# EAGLE design USB-LPC-Programmer_V3.5 (EAGLE 6.3)
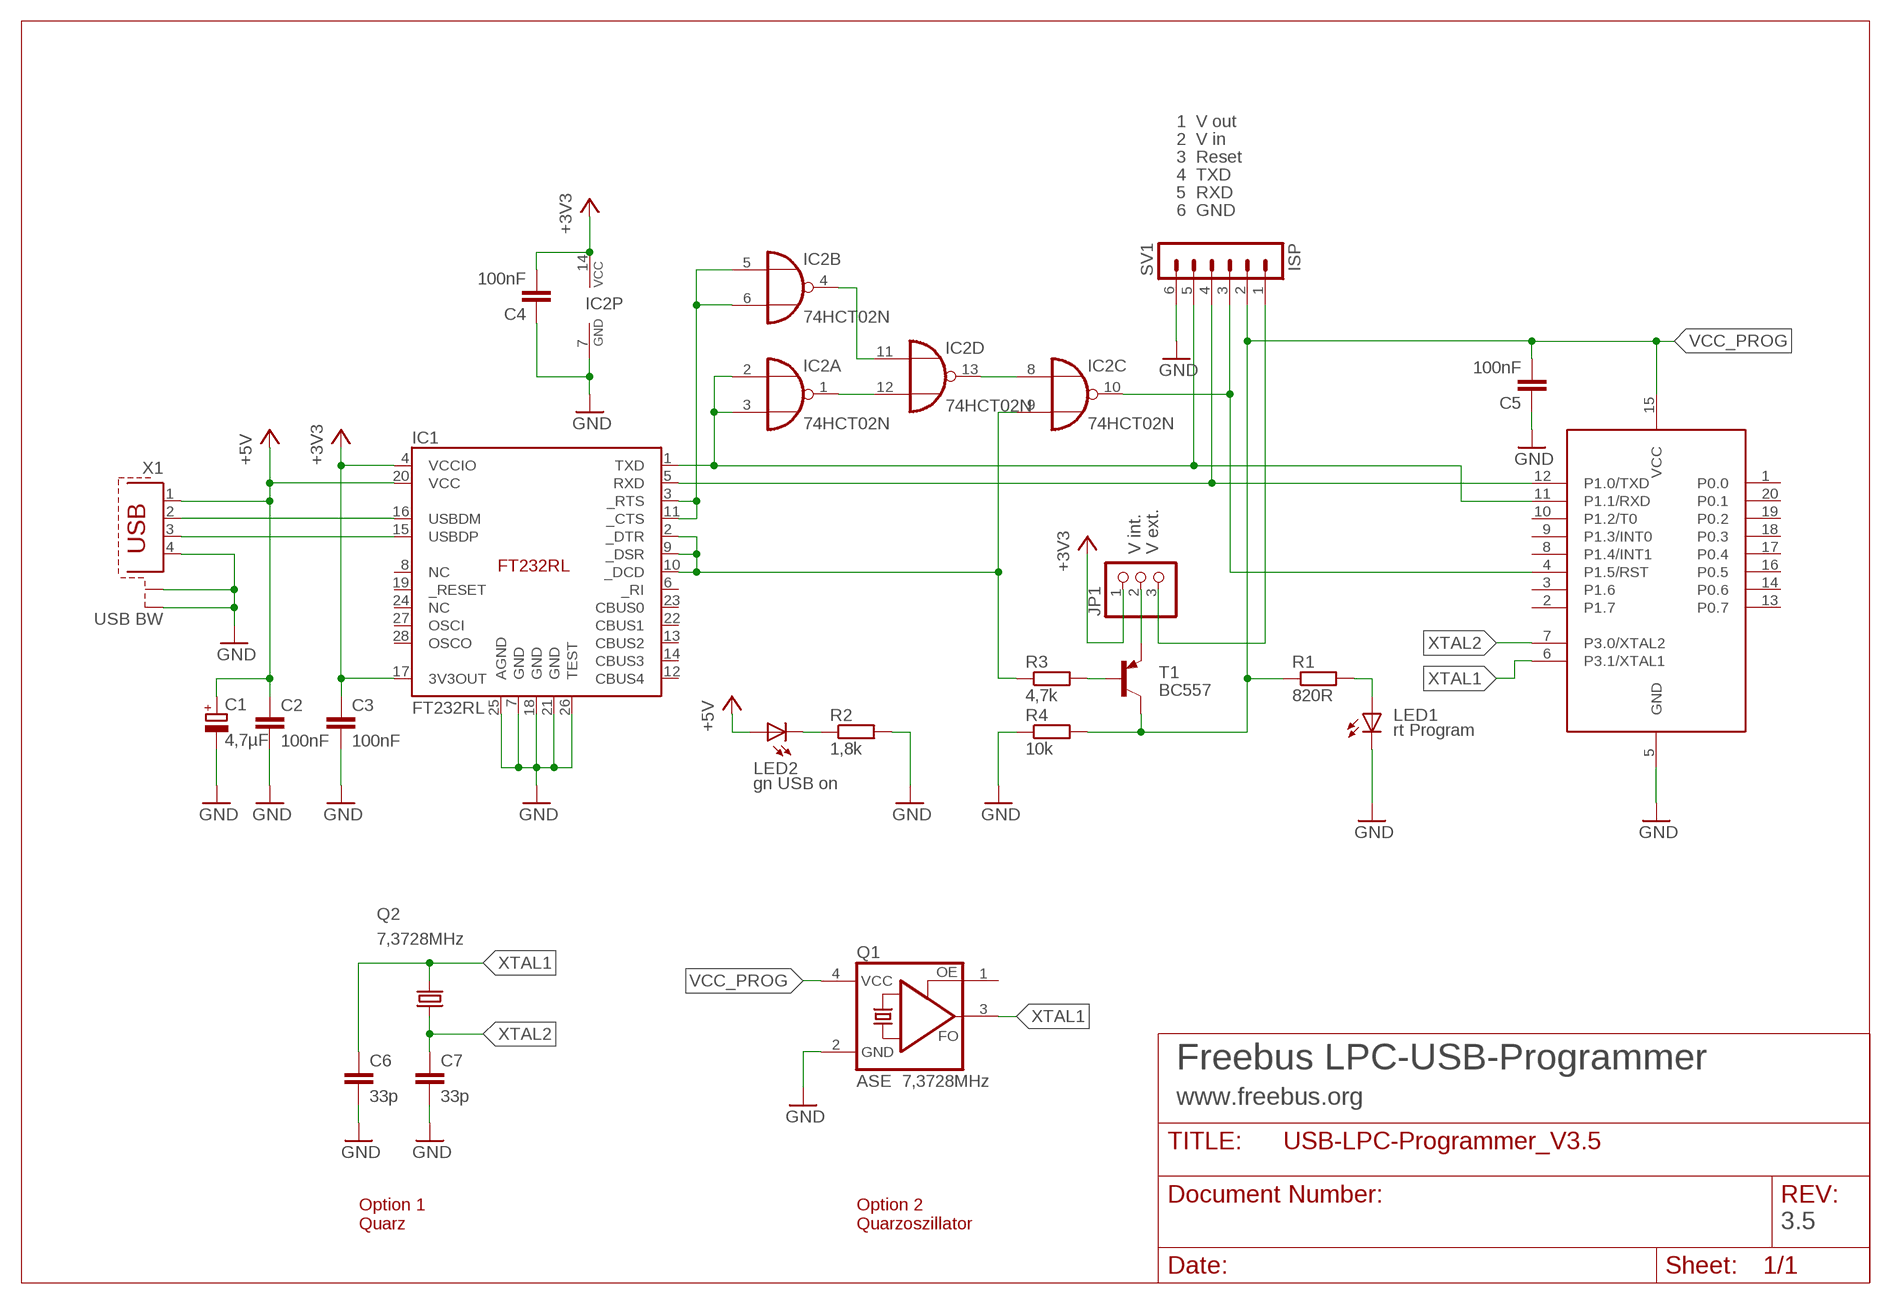
[diagram p0: schematic, sheet 1]

## Parts
89LPC922  LPC-Sockel  89LPC922  [DIL20]
C1  4,7µF  CPOL-EUE2.5-6  [E2,5-6]
C2  100nF  C-EU050-024X044  [C050-024X044]
C3  100nF  C-EU050-024X044  [C050-024X044]
C4  100nF  C-EU050-024X044  [C050-024X044]
C5  100nF  C-EU050-024X044  [C050-024X044]
C6  33p  C-EU025-024X044  [C025-024X044]
C7  33p  C-EU025-024X044  [C025-024X044]
IC1  FT232RL  [SSOP-28]
IC2  74HCT02N  [DIL14]
JP1  PINHD-1X3  [1X03]
LED1  rt Program  LED3MM  [LED3MM]
LED2  gn USB on  LED3MM  [LED3MM]
Q1  ASE 7,3728MHz  ASF1  [ASF]
Q2  7,3728MHz  CRYSTALHC49S  [HC49/S]
R1  820R  R-EU_0207/7  [0207/7]
R2  1,8k  R-EU_0207/7  [0207/7]
R3  4,7k  R-EU_0204/7  [0204/7]
R4  10k  R-EU_0207/7  [0207/7]
SV1  ISP  MA06-1  [MA06-1]
T1  BC557  [TO92]
X1  USB BW  PN61729-S  [PN61729-S]

## Nets
+3V3: C3.1 C4.2 IC1.4(VCCIO) IC1.17(3V3OUT) IC2.14(P:VCC) JP1.1
+5V: C1.+ C2.1 IC1.20(VCC) LED2.A X1.1
GND: 89LPC922.5(GND) C1.- C2.2 C3.2 C4.1 C5.1 C6.2 C7.2 IC1.7(GND) IC1.18(GND) IC1.21(GND) IC1.25(AGND) IC1.26(TEST) IC2.7(P:GND) LED1.K(C) Q1.2(GND) R2.2 R4.1 SV1.6 X1.4 X1.S1 X1.S2
N$3: IC2.4(B:O) IC2.11(D:I0)
N$4: JP1.2 T1.1(E)
N$5: 89LPC922.4(P1.5/RST) IC2.10(C:O) SV1.3
N$7: JP1.3 SV1.1
N$9: LED2.K(C) R2.1
N$10: IC2.1(A:O) IC2.12(D:I1)
N$13: LED1.A R1.2
N$14: IC1.16(USBDM) X1.2
N$15: IC2.8(C:I0) IC2.13(D:O)
N$17: IC1.15(USBDP) X1.3
N$19: R3.2 T1.2(B)
PROG_PWR_ON: IC1.2(_DTR) IC1.9(_DSR) IC1.10(_DCD) IC2.9(C:I1) R3.1
RTS_CTS1: IC1.3(_RTS) IC1.11(_CTS) IC2.5(B:I0) IC2.6(B:I1)
USB_RX: 89LPC922.12(P1.0/TXD) IC1.5(RXD) SV1.4
USB_TX: 89LPC922.11(P1.1/RXD) IC1.1(TXD) IC2.2(A:I0) IC2.3(A:I1) SV1.5
VCC_PROG: 89LPC922.15(VCC) C5.2 Q1.4(VCC) R1.1 R4.2 SV1.2 T1.3(C)
XTAL1: 89LPC922.6(P3.1/XTAL1) C6.1 Q1.3(FO) Q2.2
XTAL2: 89LPC922.7(P3.0/XTAL2) C7.1 Q2.1
Unconnected: 89LPC922.1(P0.0) 89LPC922.2(P1.7) 89LPC922.3(P1.6) 89LPC922.8(P1.4/INT1) 89LPC922.9(P1.3/INT0) 89LPC922.10(P1.2/T0) 89LPC922.13(P0.7) 89LPC922.14(P0.6) 89LPC922.16(P0.5) 89LPC922.17(P0.4) 89LPC922.18(P0.3) 89LPC922.19(P0.2) 89LPC922.20(P0.1) IC1.6(_RI) IC1.8(NC) IC1.12(CBUS4) IC1.13(CBUS2) IC1.14(CBUS3) IC1.19(_RESET) IC1.22(CBUS1) IC1.23(CBUS0) IC1.24(NC) IC1.27(OSCI) IC1.28(OSCO) Q1.1(OE)

## Notes on the sheet
- 1  V out
- 2  V in
- 3  Reset
- 4  TXD
- 5  RXD
- 6  GND
- V int. | V ext.
- Freebus LPC-USB-Programmer
- www.freebus.org
- Option 1
  Quarz
- Option 2
  Quarzoszillator
- 3.5

## Library data of the parts
89LPC922 = micro-philips:89LPC922
C1 = rcl:CPOL-EU: POLARIZED CAPACITOR, European symbol
C2-C7 = rcl:C-EU: CAPACITOR, European symbol
IC1 = ftdi4:FT232RL
IC2 = 74xx-eu:74*02: Quad 2-input NOR gate
JP1 = pinhead:PINHD-1X3: PIN HEADER
LED1 LED2 = led:LED: LED OSRAM: - CHIPLED LG R971, LG N971, LY N971, LG Q971, LY Q971, LO R971, LY R971 LH N974, LH R974 LS Q976, LO Q976, LY Q976 LO Q996 - Hyper CHIPLED LW Q18S LB Q993, LB Q99A, LB R99A - SideLED LS A670, LO A670, LY A670, LG A670, LP A670 LB A673, LV A673, LT A673, LW A673 LH A674 LY A675 LS A676, LA A676, LO A676, LY A676, LW A676 LS A679, LY A679, LG A679 - Hyper Micro SIDELED® LS Y876, LA Y876, LO Y876, LY Y876 LT Y87S - SmartLED LW L88C, LW L88S LB L89C, LB L89S, LG L890 LS L89K, LO L89K, LY L89K LS L896, LA L896, LO L896, LY L896 - TOPLED LS T670, LO T670, LY T670, LG T670, LP T670 LSG T670, LSP T670, LSY T670, LOP T670, LYG T670 LG T671, LOG T671, LSG T671 LB T673, LV T673, LT T673, LW T673 LH T674 LS T676, LA T676, LO T676, LY T676, LB T676, LH T676, LSB T676, LW T676 LB T67C, LV T67C, LT T67C, LS T67K, LO T67K, LY T67K, LW E67C LS E67B, LA E67B, LO E67B, LY E67B, LB E67C, LV E67C, LT E67C LW T67C LS T679, LY T679, LG T679 LS T770, LO T770, LY T770, LG T770, LP T770 LB T773, LV T773, LT T773, LW T773 LH T774 LS E675, LA E675, LY E675, LS T675 LS T776, LA T776, LO T776, LY T776, LB T776 LHGB T686 LT T68C, LB T68C - Hyper Mini TOPLED® LB M676 - Mini TOPLED Santana® LG M470 LS M47K, LO M47K, LY M47K Source: http://www.osram.convergy.de LUXEON: - LUMILED® LXK2-PW12-R00, LXK2-PW12-S00, LXK2-PW14-U00, LXK2-PW14-V00 LXK2-PM12-R00, LXK2-PM12-S00, LXK2-PM14-U00 LXK2-PE12-Q00, LXK2-PE12-R00, LXK2-PE12-S00, LXK2-PE14-T00, LXK2-PE14-U00 LXK2-PB12-K00, LXK2-PB12-L00, LXK2-PB12-M00, LXK2-PB14-N00, LXK2-PB14-P00, LXK2-PB14-Q00 LXK2-PR12-L00, LXK2-PR12-M00, LXK2-PR14-Q00, LXK2-PR14-R00 LXK2-PD12-Q00, LXK2-PD12-R00, LXK2-PD12-S00 LXK2-PH12-R00, LXK2-PH12-S00 LXK2-PL12-P00, LXK2-PL12-Q00, LXK2-PL12-R00 Source: www.luxeon.com KINGBRIGHT: KA-3528ASYC Source: www.kingbright.com
Q1 = crystal:ASF*: CRYSTAL CLOCK OSCILLATORS 5.0 Vdc or 3.3 Vdc - LOW PROFILE ULTRA MINIATURE CERAMIC SURFACE MOUNT Source: http://www.abracon.com/Oscillators/asf1-L-L1.pdf; OC_FARNELL: unknown; OC_NEWARK: unknown
Q2 = crystal:CRYSTAL: CRYSTAL; OC_FARNELL: 1667008; OC_NEWARK: unknown
R1-R4 = rcl:R-EU_: RESISTOR, European symbol
SV1 = con-lstb:MA06-1: PIN HEADER; OC_FARNELL: unknown; OC_NEWARK: unknown
T1 = transistor-pnp:BC557: PNP Transistor
X1 = con-berg:PN61729-S: BERG USB connector; OC_FARNELL: unknown; OC_NEWARK: unknown

## Board
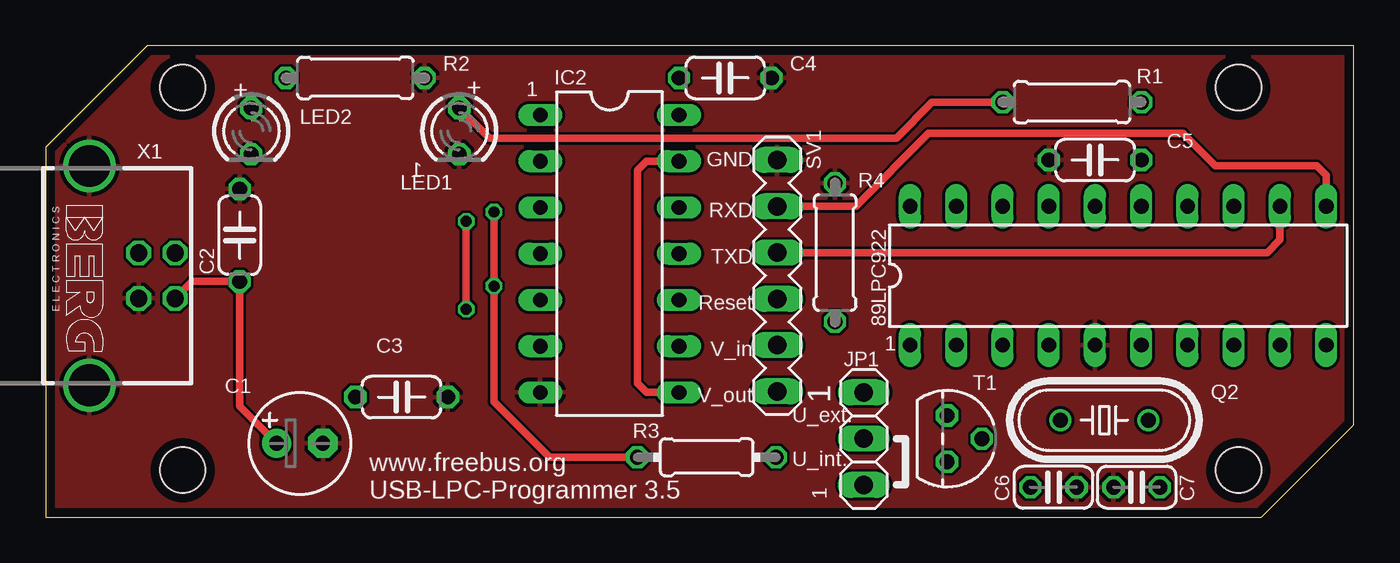
[diagram p1: board, top side]
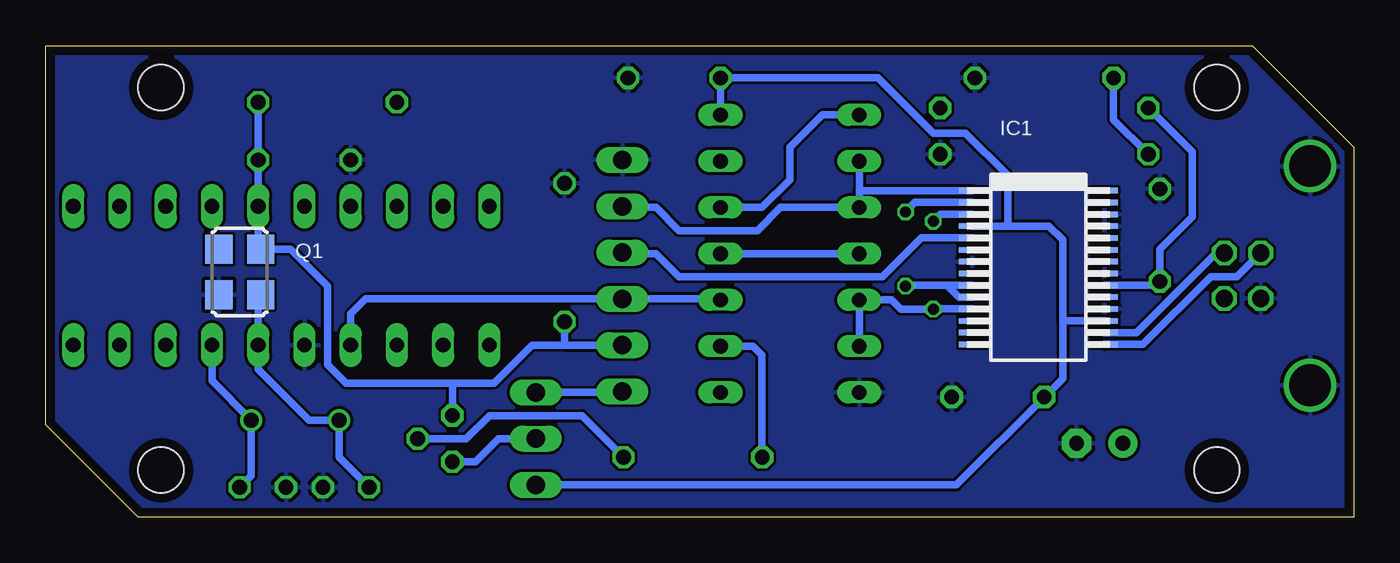
[diagram p2: board, bottom side, seen from below]

Size 71.88 x 25.91 mm. Coordinates in mm from the lower left corner, seen from the top.
Outline: 0,0 66.8,0 71.88,5.08 71.88,25.91 5.59,25.91 0,20.32 0,0
Copper layers (1*16): Top 0.035mm / dielectric 1.5mm / Bottom 0.035mm
Design rules "Eagle-DRU - 1203 - LeitOn - 01 and 02 layers": minimum track width 6mil, minimum drill 0.3mm, track to track 6mil, track to pad 6mil, pad to pad 6mil, via to via 6mil, smd to smd 6mil, copper to edge 20mil, drill to drill 10mil, minimum pad ring 8mil, minimum via ring 6mil, stop-mask expansion 3mil, vias tented up to drill 0mil, thermal gap 8mil
Holes 2.5 mm at 7.54,2.59 7.54,23.59 65.54,2.59 65.54,23.59

### Footprints (pad centres in the part's own frame; a part is rotated, then mirrored left to right if it is on the bottom)
DIL20 = drill 0.813 long: 1 -11.43,-3.81; 2 -8.89,-3.81; 3 -6.35,-3.81; 4 -3.81,-3.81; 5 -1.27,-3.81; 6 1.27,-3.81; 7 3.81,-3.81; 8 6.35,-3.81; 9 8.89,-3.81; 10 11.43,-3.81; 11 11.43,3.81; 12 8.89,3.81; 13 6.35,3.81; 14 3.81,3.81; 15 1.27,3.81; 16 -1.27,3.81; 17 -3.81,3.81; 18 -6.35,3.81; 19 -8.89,3.81; 20 -11.43,3.81
E2,5-6 = drill 0.813 pad 1.6: + -1.27,0 | drill 0.813 pad 1.6 octagon: - 1.27,0
C050-024X044 = drill 0.813 octagon: 1 -2.54,0; 2 2.54,0
C025-024X044 = drill 0.813 octagon: 1 -1.27,0; 2 1.27,0
SSOP-28 = smd 0.3 x 1.5: 1 -4.225,-3.625; 2 -3.575,-3.625; 3 -2.925,-3.625; 4 -2.275,-3.625; 5 -1.625,-3.625; 6 -0.975,-3.625; 7 -0.325,-3.625; 8 0.325,-3.625; 9 0.975,-3.625; 10 1.625,-3.625; 11 2.275,-3.625; 12 2.925,-3.625; 13 3.575,-3.625; 14 4.225,-3.625; 15 4.225,3.625; 16 3.575,3.625; 17 2.925,3.625; 18 2.275,3.625; 19 1.625,3.625; 20 0.975,3.625; 21 0.325,3.625; 22 -0.325,3.625; 23 -0.975,3.625; 24 -1.625,3.625; 25 -2.275,3.625; 26 -2.925,3.625; 27 -3.575,3.625; 28 -4.225,3.625
DIL14 = drill 0.813 long: 1 -7.62,-3.81; 2 -5.08,-3.81; 3 -2.54,-3.81; 4 0,-3.81; 5 2.54,-3.81; 6 5.08,-3.81; 7 7.62,-3.81; 8 7.62,3.81; 9 5.08,3.81; 10 2.54,3.81; 11 0,3.81; 12 -2.54,3.81; 13 -5.08,3.81; 14 -7.62,3.81
1X03 = drill 1.016 long: 1 -2.54,0; 2 0,0; 3 2.54,0
LED3MM = drill 0.813 octagon: A -1.27,0; K 1.27,0
ASF = smd 1.6 x 1.5: 1 -1.25,-1.15; 2 1.25,-1.15; 3 1.25,1.15; 4 -1.25,1.15
HC49/S = drill 0.813: 1 -2.413,0; 2 2.413,0
0207/7 = drill 0.813 octagon: 1 -3.81,0; 2 3.81,0
0204/7 = drill 0.813 octagon: 1 -3.81,0; 2 3.81,0
MA06-1 = drill 1.016 long: 1 -6.35,0; 2 -3.81,0; 3 -1.27,0; 4 1.27,0; 5 3.81,0; 6 6.35,0
TO92 = drill 0.813 octagon: 1 1.27,0; 2 0,1.905; 3 -1.27,0
PN61729-S = drill 0.95 octagon: 1 1.25,4.71; 2 -1.25,4.71; 3 -1.25,2.71; 4 1.25,2.71 | drill 2.3 pad 2.9: S1 -6.02,0; S2 6.02,0

### Placement (x,y rotation side)
89LPC922  58.93,13.27 0 top
C1  13.97,4.06 0 top
C2  10.67,15.49 90 top
C3  19.56,6.6 0 top
C4  37.34,24.13 180 top
C5  57.66,19.62 0 top
C6  55.37,1.65 0 top
C7  59.94,1.65 180 top
IC1  17.34,13.72 270 bottom
IC2  30.99,14.48 270 top
JP1  44.96,4.32 90 top
LED1  22.73,21.21 270 top
LED2  11.3,21.21 270 top
Q1  61.21,13.46 270 bottom
Q2  58.17,5.33 180 top
R1  56.39,22.8 180 top
R2  17.02,24.13 0 top
R3  36.32,3.3 0 top
R4  43.37,14.54 270 top
SV1  40.2,13.27 90 top
T1  49.53,4.32 270 top
X1  2.41,13.27 270 top

### Tracks (layer width: path | path; a pad name or v marks a point on that pad's centre or on a via)
+3V3
  Bottom 0.406: IC1.17 16,10.79 | 16,10.79 16,15.24 16.75,15.99 19.03,15.99 | 19.03,15.99 IC1.4 | IC2.14 C4.2 26.16,24.13 23.11,21.08 21.34,21.08 19.03,18.77 19.03,15.99 | 16,10.79 16,7.62 C3.1 21.84,1.78 JP1.1
+5V
  Top 0.406: X1.1 8.06,12.95 C2.1 10.67,6.1 C1.+
  Bottom 0.406: IC1.20 10.88,12.74 C2.1 10.67,14.73 8.89,16.51 8.89,20.07 LED2.A
GND
  pour Bottom: 0,0 66.8,0 71.88,5.08 71.88,25.91 5.59,25.91 0,20.32
  pour Top: 0,0 66.8,0 71.88,5.08 71.88,25.91 5.59,25.91 0,20.32
N$3
  Bottom 0.406: IC2.4 IC2.11
N$4
  Bottom 0.406: T1.1 48.26,3.05 46.99,4.32 JP1.2
N$5
  Bottom 0.406: IC2.10 34.8,12 SV1.3 54.29,12 55.12,11.18 89LPC922.4
N$7
  Bottom 0.406: JP1.3 40.26,6.86 SV1.1
N$9
  Bottom 0.406: R2.1 13.21,21.84 LED2.K
N$10
  Bottom 0.406: IC2.1 29.21,22.1 30.99,20.32 30.99,18.54 32.51,17.02 IC2.12
N$13
  Top 0.406: LED1.A 24.38,20.83 46.74,20.83 48.7,22.8 R1.2
N$14
  Bottom 0.406: IC1.16 11.96,10.14 7.58,14.52 X1.2
N$15
  Top 0.406: IC2.8 33.02,6.86 32.51,7.37 32.51,19.05 33.02,19.56 IC2.13
N$17
  Bottom 0.406: X1.3 6.44,13.21 7.87,13.21 11.59,9.49 IC1.15
N$19
  Bottom 0.406: T1.2 48.77,4.32 47.5,5.59 42.42,5.59 R3.2
PROG_PWR_ON  (via drill 0.6)
  Top 0.406: v24.64,16.76 v24.64,12.7 24.64,6.35 27.69,3.3 R3.1
  Bottom 0.406: R3.1 32.51,8.89 33.02,9.4 IC2.9 | IC1.2 24.11,17.29 v24.64,16.76 | IC1.9 22.35,12.74 | 22.35,12.74 24.6,12.74 v24.64,12.7 | IC1.10 21.7,12.09 22.35,12.74
RTS_CTS1  (via drill 0.6)
  Top 0.406: v23.11,11.43 v23.11,16.26
  Bottom 0.406: IC2.6 IC2.5 25.4,11.94 24.89,11.43 v23.11,11.43 23.1,11.44 IC1.11 | IC1.3 22.73,16.64 v23.11,16.26
USB_RX
  Top 0.406: SV1.4 67.12,14.54 67.82,15.24 89LPC922.12
  Bottom 0.406: IC1.5 23.77,15.34 25.91,13.21 37.08,13.21 38.35,14.48 40.13,14.48 SV1.4
USB_TX
  Top 0.406: SV1.5 44.51,17.08 48.51,21.08 62.48,21.08 64.26,19.3 69.85,19.3 70.36,18.8 89LPC922.11
  Bottom 0.406: IC2.2 27.18,18.03 | 27.18,18.03 IC2.3 31.5,17.02 32.77,15.75 37.08,15.75 38.35,17.02 40.13,17.02 SV1.5 | IC1.1 27.09,17.94 27.18,18.03
VCC_PROG
  Bottom 0.406: R1.1 C5.2 89LPC922.15 60.2,14.85 Q1.4 60.04,14.73 58.42,14.73 56.39,12.7 56.39,8.38 55.37,7.37 49.53,7.37 | 43.38,9.46 SV1.2 | R4.2 43.38,9.46 | 43.38,9.46 45.15,9.46 47.24,7.37 49.53,7.37 | T1.3 49.53,7.37
XTAL1
  Bottom 0.406: Q1.3 60.2,12.21 89LPC922.6 60.2,8.13 57.4,5.33 Q2.2 55.75,3.3 C6.1
XTAL2
  Bottom 0.406: 89LPC922.7 62.74,7.49 Q2.1 60.58,2.29 C7.1

### Text on the board
tPlace: + | + | 1 | GND | 1 | RXD | TXD | Reset | V_in | 1 | V_out | U_ext. | U_int. | www.freebus.org / USB-LPC-Programmer 3.5 | 1